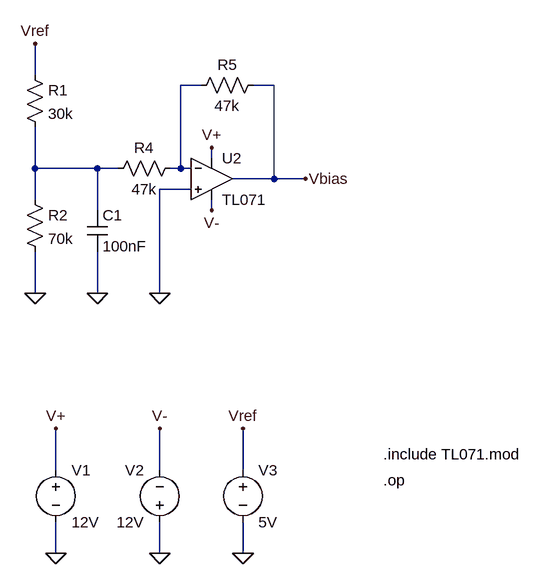
[diagram p0: schematic NegativeBiasBuffer.asc]
NegativeBiasBuffer.asc, the LTspice schematic file:
Version 4
SHEET 1 1144 1588
WIRE -272 -96 -272 -144
WIRE -16 -80 -48 -80
WIRE 96 -80 64 -80
WIRE 0 32 0 16
WIRE -272 48 -272 -16
WIRE -176 48 -272 48
WIRE -144 48 -176 48
WIRE -48 48 -48 -80
WIRE -48 48 -64 48
WIRE -32 48 -48 48
WIRE 96 64 96 -80
WIRE 96 64 32 64
WIRE 144 64 96 64
WIRE -32 80 -80 80
WIRE -272 96 -272 48
WIRE -176 112 -176 48
WIRE 0 112 0 96
WIRE -272 240 -272 176
WIRE -176 240 -176 176
WIRE -80 240 -80 80
WIRE -240 512 -240 448
WIRE -80 512 -80 448
WIRE 48 512 48 448
WIRE -240 640 -240 592
WIRE -80 640 -80 592
WIRE 48 640 48 592
FLAG -240 640 0
FLAG -80 640 0
FLAG -240 448 V+
FLAG 0 16 V+
FLAG -80 448 V-
FLAG 0 112 V-
FLAG 48 640 0
FLAG 48 448 Vref
FLAG -272 -144 Vref
FLAG -272 240 0
FLAG 144 64 Vbias
FLAG -176 240 0
FLAG -80 240 0
SYMBOL voltage -240 496 R0
SYMATTR InstName V1
SYMATTR Value 12V
SYMBOL voltage -80 608 R180
WINDOW 0 24 96 Left 2
WINDOW 3 24 16 Left 2
SYMATTR InstName V2
SYMATTR Value 12V
SYMBOL Opamps\\opamp2 0 0 R0
SYMATTR InstName U2
SYMATTR Value TL071
SYMBOL voltage 48 496 R0
SYMATTR InstName V3
SYMATTR Value 5V
SYMBOL res -288 -112 R0
SYMATTR InstName R1
SYMATTR Value 30k
SYMBOL res -288 80 R0
SYMATTR InstName R2
SYMATTR Value 70k
SYMBOL cap -192 112 R0
SYMATTR InstName C1
SYMATTR Value 100nF
SYMBOL res -48 32 R90
WINDOW 0 0 56 VBottom 2
WINDOW 3 32 56 VTop 2
SYMATTR InstName R4
SYMATTR Value 47k
SYMBOL res 80 -96 R90
WINDOW 0 0 56 VBottom 2
WINDOW 3 32 56 VTop 2
SYMATTR InstName R5
SYMATTR Value 47k
TEXT 264 488 Left 2 !.include TL071.mod
TEXT 264 528 Left 2 !.op

The netlist it stands for:
* NegativeBiasBuffer.asc
V1 V+ 0 12V
V2 0 V- 12V
XU2 0 N001 V+ V- Vbias TL071  ; pins In+ In- V+ V- OUT
V3 Vref 0 5V
R1 Vref N002 30k
R2 N002 0 70k
C1 N002 0 100nF
R4 N001 N002 47k
R5 Vbias N001 47k
.include TL071.mod
.op
.backanno
.end